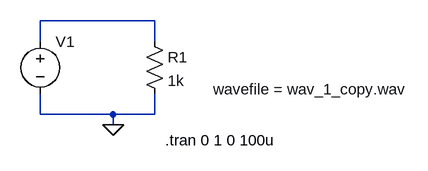
[diagram p0: schematic wave_read.asc]
wave_read.asc, the LTspice schematic file:
Version 4
SHEET 1 880 680
WIRE 192 112 16 112
WIRE 16 144 16 112
WIRE 192 144 192 112
WIRE 16 256 16 224
WIRE 128 256 16 256
WIRE 192 256 192 224
WIRE 192 256 128 256
WIRE 128 272 128 256
FLAG 128 272 0
SYMBOL voltage 16 128 R0
WINDOW 3 266 89 Left 2
SYMATTR InstName V1
SYMATTR Value wavefile = wav_1_copy.wav
SYMBOL res 176 128 R0
SYMATTR InstName R1
SYMATTR Value 1k
TEXT 208 296 Left 2 !.tran 0 1 0 100u

The netlist it stands for:
* wave_read.asc
V1 N001 0 wavefile = wav_1_copy.wav
R1 N001 0 1k
.tran 0 1 0 100u
.backanno
.end